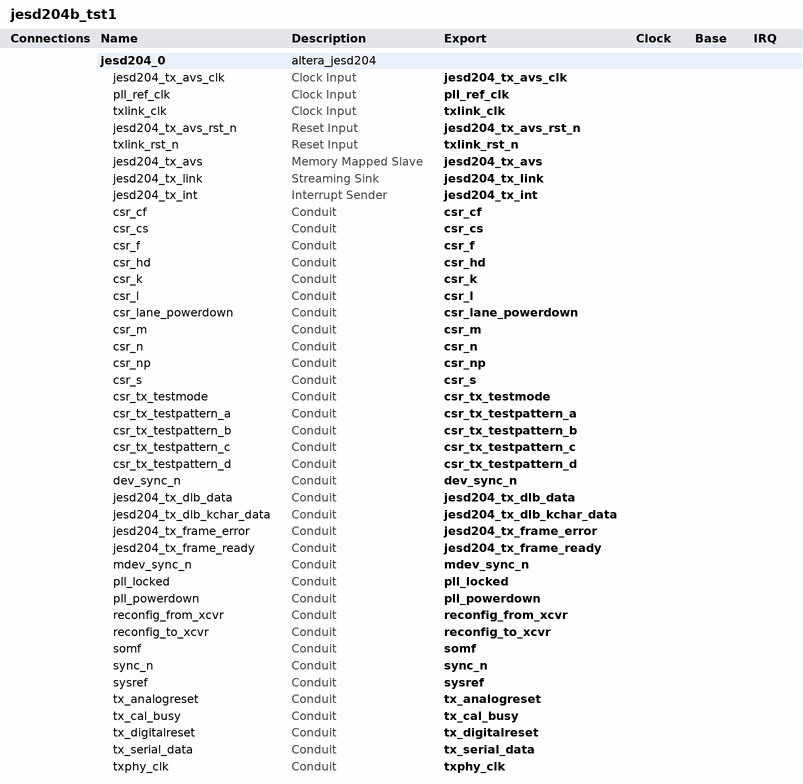
[diagram p0: system contents]
# Platform Designer (Qsys) system jesd204b_tst1, Arria V 5AGXMA7G4F31C4
# Parameters at their usual value, and those the tool derives, are not listed.
package require -exact qsys 17.0
create_system jesd204b_tst1
set_project_property DEVICE_FAMILY {Arria V}
set_project_property DEVICE 5AGXMA7G4F31C4

add_instance jesd204_0 altera_jesd204 17.0
set_instance_property jesd204_0 AUTO_EXPORT true
set_instance_parameter_value jesd204_0 ADJCNT 0
set_instance_parameter_value jesd204_0 ADJDIR 0
set_instance_parameter_value jesd204_0 BID 0
set_instance_parameter_value jesd204_0 CF 0
set_instance_parameter_value jesd204_0 CS 0
set_instance_parameter_value jesd204_0 DATA_PATH TX
set_instance_parameter_value jesd204_0 DID 0
set_instance_parameter_value jesd204_0 DLB_TEST 0
set_instance_parameter_value jesd204_0 ECC_EN 0
set_instance_parameter_value jesd204_0 ED_DEV_KIT NONE
set_instance_parameter_value jesd204_0 ED_FILESET_SIM true
set_instance_parameter_value jesd204_0 ED_FILESET_SYNTH true
set_instance_parameter_value jesd204_0 ED_GENERIC_5SERIES RTL
set_instance_parameter_value jesd204_0 ED_GENERIC_A10 No
set_instance_parameter_value jesd204_0 ED_GENERIC_S10 No
set_instance_parameter_value jesd204_0 ED_HDL_FORMAT_SIM VERILOG
set_instance_parameter_value jesd204_0 ED_HDL_FORMAT_SYNTH VERILOG
set_instance_parameter_value jesd204_0 GUI_CFG_F 4
set_instance_parameter_value jesd204_0 GUI_EN_CFG_F false
set_instance_parameter_value jesd204_0 HD 0
set_instance_parameter_value jesd204_0 JESDV 1
set_instance_parameter_value jesd204_0 K 16
set_instance_parameter_value jesd204_0 L 1
set_instance_parameter_value jesd204_0 LID0 0
set_instance_parameter_value jesd204_0 LID1 1
set_instance_parameter_value jesd204_0 LID2 2
set_instance_parameter_value jesd204_0 LID3 3
set_instance_parameter_value jesd204_0 LID4 4
set_instance_parameter_value jesd204_0 LID5 5
set_instance_parameter_value jesd204_0 LID6 6
set_instance_parameter_value jesd204_0 LID7 7
set_instance_parameter_value jesd204_0 M 2
set_instance_parameter_value jesd204_0 N 12
set_instance_parameter_value jesd204_0 N_PRIME 16
set_instance_parameter_value jesd204_0 OPTIMIZE 0
set_instance_parameter_value jesd204_0 PCS_CONFIG JESD_PCS_CFG1
set_instance_parameter_value jesd204_0 PHADJ 0
set_instance_parameter_value jesd204_0 REFCLK_FREQ 96.0
set_instance_parameter_value jesd204_0 RES1 0
set_instance_parameter_value jesd204_0 RES2 0
set_instance_parameter_value jesd204_0 S 1
set_instance_parameter_value jesd204_0 SCR 0
set_instance_parameter_value jesd204_0 SUBCLASSV 1
set_instance_parameter_value jesd204_0 TERMINATE_RECONFIG_EN false
set_instance_parameter_value jesd204_0 TEST_COMPONENTS_EN false
set_instance_parameter_value jesd204_0 bitrev_en false
set_instance_parameter_value jesd204_0 bonded_mode bonded
set_instance_parameter_value jesd204_0 lane_rate 1920.0
set_instance_parameter_value jesd204_0 part_trait_bd ARRIAVA7
set_instance_parameter_value jesd204_0 part_trait_dp 5AGXMA7G4F31C4
set_instance_parameter_value jesd204_0 pll_reconfig_enable false
set_instance_parameter_value jesd204_0 pll_type CMU
set_instance_parameter_value jesd204_0 rcfg_jtag_enable false
set_instance_parameter_value jesd204_0 rcfg_shared true
set_instance_parameter_value jesd204_0 sdc_constraint 1.0
set_instance_parameter_value jesd204_0 set_capability_reg_enable false
set_instance_parameter_value jesd204_0 set_csr_soft_logic_enable false
set_instance_parameter_value jesd204_0 set_prbs_soft_logic_enable false
set_instance_parameter_value jesd204_0 set_user_identifier 0
set_instance_parameter_value jesd204_0 wrapper_opt base_phy

# exported interfaces
add_interface csr_cf conduit end
set_interface_property csr_cf EXPORT_OF jesd204_0.csr_cf
add_interface csr_cs conduit end
set_interface_property csr_cs EXPORT_OF jesd204_0.csr_cs
add_interface csr_f conduit end
set_interface_property csr_f EXPORT_OF jesd204_0.csr_f
add_interface csr_hd conduit end
set_interface_property csr_hd EXPORT_OF jesd204_0.csr_hd
add_interface csr_k conduit end
set_interface_property csr_k EXPORT_OF jesd204_0.csr_k
add_interface csr_l conduit end
set_interface_property csr_l EXPORT_OF jesd204_0.csr_l
add_interface csr_lane_powerdown conduit end
set_interface_property csr_lane_powerdown EXPORT_OF jesd204_0.csr_lane_powerdown
add_interface csr_m conduit end
set_interface_property csr_m EXPORT_OF jesd204_0.csr_m
add_interface csr_n conduit end
set_interface_property csr_n EXPORT_OF jesd204_0.csr_n
add_interface csr_np conduit end
set_interface_property csr_np EXPORT_OF jesd204_0.csr_np
add_interface csr_s conduit end
set_interface_property csr_s EXPORT_OF jesd204_0.csr_s
add_interface csr_tx_testmode conduit end
set_interface_property csr_tx_testmode EXPORT_OF jesd204_0.csr_tx_testmode
add_interface csr_tx_testpattern_a conduit end
set_interface_property csr_tx_testpattern_a EXPORT_OF jesd204_0.csr_tx_testpattern_a
add_interface csr_tx_testpattern_b conduit end
set_interface_property csr_tx_testpattern_b EXPORT_OF jesd204_0.csr_tx_testpattern_b
add_interface csr_tx_testpattern_c conduit end
set_interface_property csr_tx_testpattern_c EXPORT_OF jesd204_0.csr_tx_testpattern_c
add_interface csr_tx_testpattern_d conduit end
set_interface_property csr_tx_testpattern_d EXPORT_OF jesd204_0.csr_tx_testpattern_d
add_interface dev_sync_n conduit end
set_interface_property dev_sync_n EXPORT_OF jesd204_0.dev_sync_n
add_interface jesd204_tx_avs avalon slave
set_interface_property jesd204_tx_avs EXPORT_OF jesd204_0.jesd204_tx_avs
add_interface jesd204_tx_avs_clk clock sink
set_interface_property jesd204_tx_avs_clk EXPORT_OF jesd204_0.jesd204_tx_avs_clk
add_interface jesd204_tx_avs_rst_n reset sink
set_interface_property jesd204_tx_avs_rst_n EXPORT_OF jesd204_0.jesd204_tx_avs_rst_n
add_interface jesd204_tx_dlb_data conduit end
set_interface_property jesd204_tx_dlb_data EXPORT_OF jesd204_0.jesd204_tx_dlb_data
add_interface jesd204_tx_dlb_kchar_data conduit end
set_interface_property jesd204_tx_dlb_kchar_data EXPORT_OF jesd204_0.jesd204_tx_dlb_kchar_data
add_interface jesd204_tx_frame_error conduit end
set_interface_property jesd204_tx_frame_error EXPORT_OF jesd204_0.jesd204_tx_frame_error
add_interface jesd204_tx_frame_ready conduit end
set_interface_property jesd204_tx_frame_ready EXPORT_OF jesd204_0.jesd204_tx_frame_ready
add_interface jesd204_tx_int interrupt sender
set_interface_property jesd204_tx_int EXPORT_OF jesd204_0.jesd204_tx_int
add_interface jesd204_tx_link avalon_streaming sink
set_interface_property jesd204_tx_link EXPORT_OF jesd204_0.jesd204_tx_link
add_interface mdev_sync_n conduit end
set_interface_property mdev_sync_n EXPORT_OF jesd204_0.mdev_sync_n
add_interface pll_locked conduit end
set_interface_property pll_locked EXPORT_OF jesd204_0.pll_locked
add_interface pll_powerdown conduit end
set_interface_property pll_powerdown EXPORT_OF jesd204_0.pll_powerdown
add_interface pll_ref_clk clock sink
set_interface_property pll_ref_clk EXPORT_OF jesd204_0.pll_ref_clk
add_interface reconfig_from_xcvr conduit end
set_interface_property reconfig_from_xcvr EXPORT_OF jesd204_0.reconfig_from_xcvr
add_interface reconfig_to_xcvr conduit end
set_interface_property reconfig_to_xcvr EXPORT_OF jesd204_0.reconfig_to_xcvr
add_interface somf conduit end
set_interface_property somf EXPORT_OF jesd204_0.somf
add_interface sync_n conduit end
set_interface_property sync_n EXPORT_OF jesd204_0.sync_n
add_interface sysref conduit end
set_interface_property sysref EXPORT_OF jesd204_0.sysref
add_interface tx_analogreset conduit end
set_interface_property tx_analogreset EXPORT_OF jesd204_0.tx_analogreset
add_interface tx_cal_busy conduit end
set_interface_property tx_cal_busy EXPORT_OF jesd204_0.tx_cal_busy
add_interface tx_digitalreset conduit end
set_interface_property tx_digitalreset EXPORT_OF jesd204_0.tx_digitalreset
add_interface tx_serial_data conduit end
set_interface_property tx_serial_data EXPORT_OF jesd204_0.tx_serial_data
add_interface txlink_clk clock sink
set_interface_property txlink_clk EXPORT_OF jesd204_0.txlink_clk
add_interface txlink_rst_n reset sink
set_interface_property txlink_rst_n EXPORT_OF jesd204_0.txlink_rst_n
add_interface txphy_clk conduit end
set_interface_property txphy_clk EXPORT_OF jesd204_0.txphy_clk

set_interconnect_requirement {$system} qsys_mm.clockCrossingAdapter HANDSHAKE
set_interconnect_requirement {$system} qsys_mm.enableEccProtection FALSE
set_interconnect_requirement {$system} qsys_mm.insertDefaultSlave FALSE
set_interconnect_requirement {$system} qsys_mm.maxAdditionalLatency 1

save_system jesd204b_tst1.qsys
